# EasyEDA schematic 1-Schematic_双路pwm调光+光强GY-30.json
TITLE: Sheet_1; REV: 1.0; Date: 2020-07-02; Sheet: 1/1; Drawn By: foggyhlw; Company: Your Company
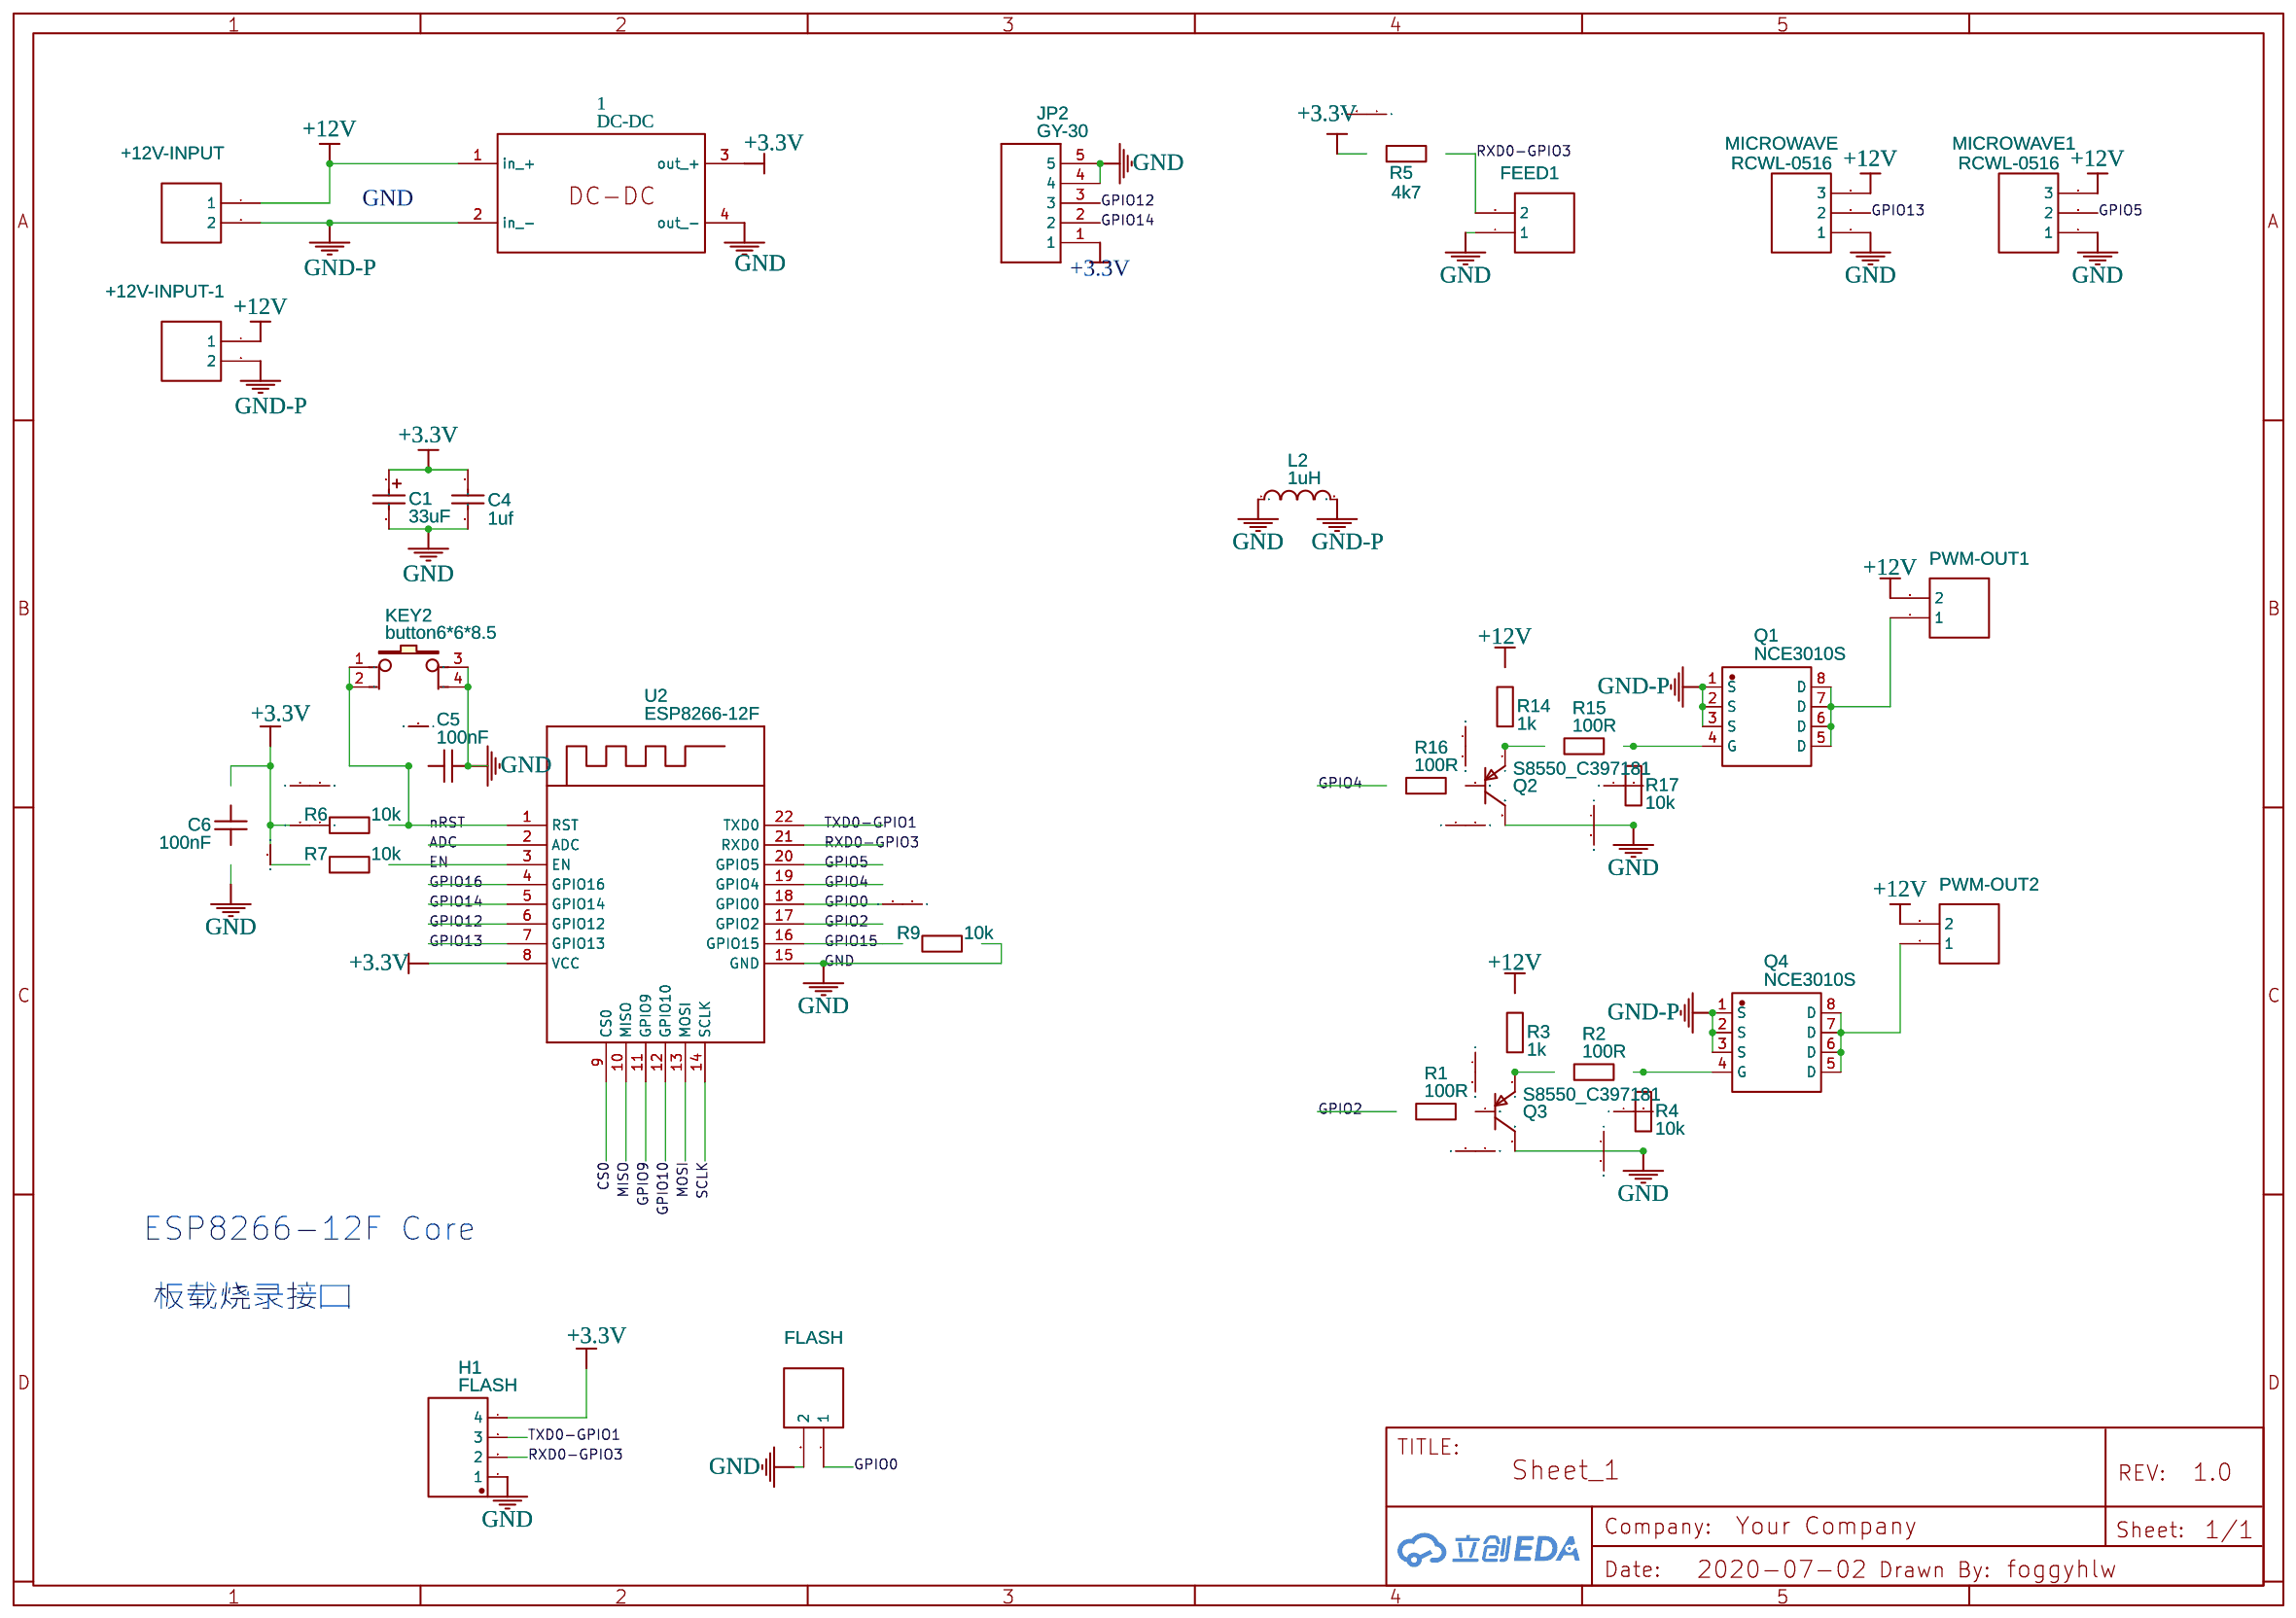
[diagram p0: schematic sheet]

## Parts
1  DC-DC  [电源模块]
+12V-INPUT  SIP2  [CONN-TH_2P-P5.08_DB2EVC-5.08-2P]
+12V-INPUT-1  SIP2  [5.5MMDC电源座]
C1  33uF  [CAP-SMD_L3.5-W2.8-R-RD]
C4  1uf  [C0805]
C5  100nF  [C0603]
C6  100nF  [C0603]
FEED1  SIP2  [HDR1X2]
FLASH  SIP2  [HDR1X2]
H1  FLASH  [HDR-TH_4P-P2.54-V]
JP2  GY-30  [HDR-TH_5P-P2.54-V_Z-211-0511-0021-001]
KEY2  button6*6*8.5  [KEY-TH_4P-L6.0-W6.0-P4.50]
L2  1uH  [IND-TH_BD4.0-L10.5-P14.50-D0.6]
MICROWAVE  RCWL-0516  [HDR1X3]
MICROWAVE1  RCWL-0516  [HDR1X3]
PWM-OUT1  SIP2  [CONN-TH_2P-P5.08_DB2EVC-5.08-2P-BK]
PWM-OUT2  SIP2  [CONN-TH_2P-P5.08_DB2EVC-5.08-2P-BK]
Q1  NCE3010S  [SOP-8_L4.9-W3.9-P1.27-LS6.0-BL]
Q2  S8550_C397181  [SOT-23_L2.9-W1.3-P0.95-LS2.4-BR]
Q3  S8550_C397181  [SOT-23_L2.9-W1.3-P0.95-LS2.4-BR]
Q4  NCE3010S  [SOP-8_L4.9-W3.9-P1.27-LS6.0-BL]
R1  100R  [R0805]
R2  100R  [R0805]
R3  1k  [R0805]
R4  10k  [R0805]
R5  4k7  [R0805]
R6  10k  [R0805]
R7  10k  [R0805]
R9  10k  [R0805]
R14  1k  [R0805]
R15  100R  [R0805]
R16  100R  [R0805]
R17  10k  [R0805]
U2  ESP8266-12F  [LGA22-2.0-24X16MM]

## Library data of the parts
+12V-INPUT +12V-INPUT-1 FEED1 FLASH MICROWAVE MICROWAVE1 PWM-OUT1 PWM-OUT2 = -: catid: 20; Manufacturer Part: ?
C1 = CA45-B016K336T: Supplier: LCSC; Manufacturer: Xiangyee; Supplier Part: C122647; LCSC Assembly: Yes; SMT Type: Extend
C4 = -: Capacitor; catid: 20; sourceId: aYgasJ1jB; Manufacturer Part: ?
C5 C6 = Capacitor: Manufacturer Part: ?
H1 = Header-Male-2.54_1x4: Supplier: LCSC; Manufacturer: Ckmtw; Manufacturer Part: 210S-1*4P L=11.6MMGold-plated black; Contributor: LCSC; Supplier Part: C124378
JP2 = 5PIN
KEY2 = button6*6*8.5: Supplier Part: C59980; Supplier: LCSC; Manufacturer: ReliaPro; image: http://image.lceda.cn/szlcsc/C59980.jpg
L2 = LGA0410-1R0KP52E: Supplier: LCSC; Manufacturer: FH; Supplier Part: C72359
Q1 Q4 = NCE3010S: Supplier: LCSC; Manufacturer: Ncepower; Supplier Part: C126152; LCSC Assembly: Yes; SMT Type: Extend
Q2 Q3 = S8550_C397181: Supplier: LCSC; Supplier Part: C397181; Manufacturer: AnBon; Manufacturer Part: S8550; Contributor: LCSC
R1-R7 R9 R14-R17 = Resistor: Manufacturer Part: ?
U2 = -: SMD ESP8266 based WiFi module FCC/CE; catid: 20; Manufacturer Part: ESP8266-12F/ESP-12F; sourceId: K4gQpZzx7

## Nets
+3.3V: 1.3(out +) C1.1 C4.2 C6.2 H1.4 JP2.1 R5.1 R6.1 R7.1 U2.8(VCC)
+12V: 1.1(in +) +12V-INPUT.1 +12V-INPUT-1.1 MICROWAVE.3 MICROWAVE1.3 PWM-OUT1.2 PWM-OUT2.2 R3.2 R14.2
GND: 1.4(out -) C1.2 C4.1 C5.2 C6.1 FEED1.1 FLASH.2 H1.1 JP2.4 JP2.5 KEY2.3 KEY2.4 L2.1 MICROWAVE.1 MICROWAVE1.1 Q2.3(C) Q3.3(C) R4.1 R9.2 R17.1 U2.15(GND)
GND-P: 1.2(in -) +12V-INPUT.2 +12V-INPUT-1.2 L2.2 Q1.1(S) Q1.2(S) Q1.3(S) Q4.1(S) Q4.2(S) Q4.3(S)
ADC: U2.2(ADC)
CS0: U2.9(CS0)
EN: R7.2 U2.3(EN)
GPIO0: FLASH.1 U2.18(GPIO0)
GPIO2: R1.2 U2.17(GPIO2)
GPIO4: R16.2 U2.19(GPIO4)
GPIO5: MICROWAVE1.2 U2.20(GPIO5)
GPIO9: U2.11(GPIO9)
GPIO10: U2.12(GPIO10)
GPIO12: JP2.3 U2.6(GPIO12)
GPIO13: MICROWAVE.2 U2.7(GPIO13)
GPIO14: JP2.2 U2.5(GPIO14)
GPIO15: R9.1 U2.16(GPIO15)
GPIO16: U2.4(GPIO16)
MISO: U2.10(MISO)
MOSI: U2.13(MOSI)
nRST: C5.1 KEY2.1 KEY2.2 R6.2 U2.1(RST)
RXD0-GPIO3: FEED1.2 H1.2 R5.2 U2.21(RXD0)
SCLK: U2.14(SCLK)
TXD0-GPIO1: H1.3 U2.22(TXD0)
Net-(PWM-OUT1-1): PWM-OUT1.1 Q1.5(D) Q1.6(D) Q1.7(D) Q1.8(D)
Net-(PWM-OUT2-1): PWM-OUT2.1 Q4.5(D) Q4.6(D) Q4.7(D) Q4.8(D)
Net-(Q1-4): Q1.4(G) R15.1 R17.2
Net-(Q2-1): Q2.1(B) R16.1
Net-(Q2-2): Q2.2(E) R14.1 R15.2
Net-(Q3-1): Q3.1(B) R1.1
Net-(Q3-2): Q3.2(E) R2.2 R3.1
Net-(Q4-4): Q4.4(G) R2.1 R4.2

## Notes on the sheet
- GND
- ESP8266-12F Core
- 板载烧录接口
